# Altium project hd-gs-alt.PrjPcb
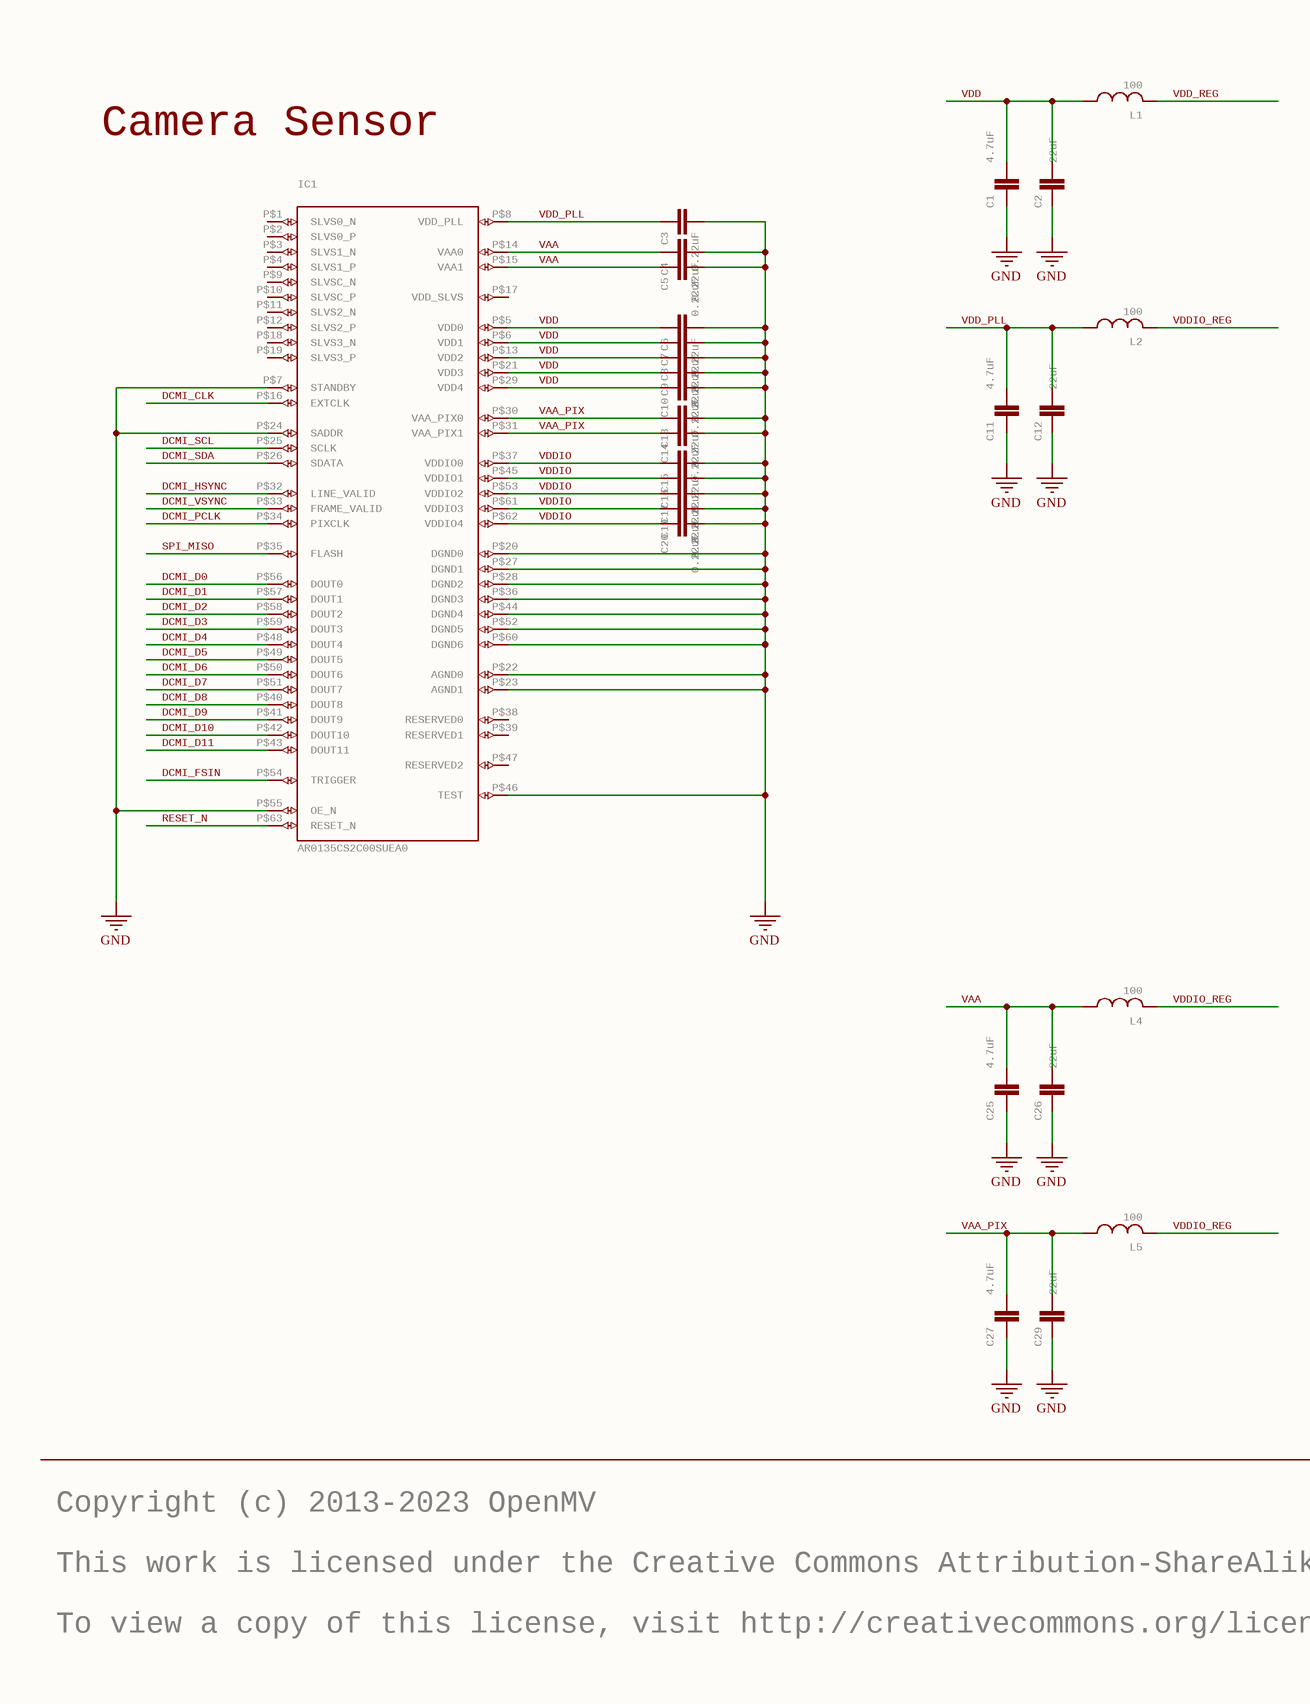
[diagram p0: hd-gs-alt.SchDoc, left]
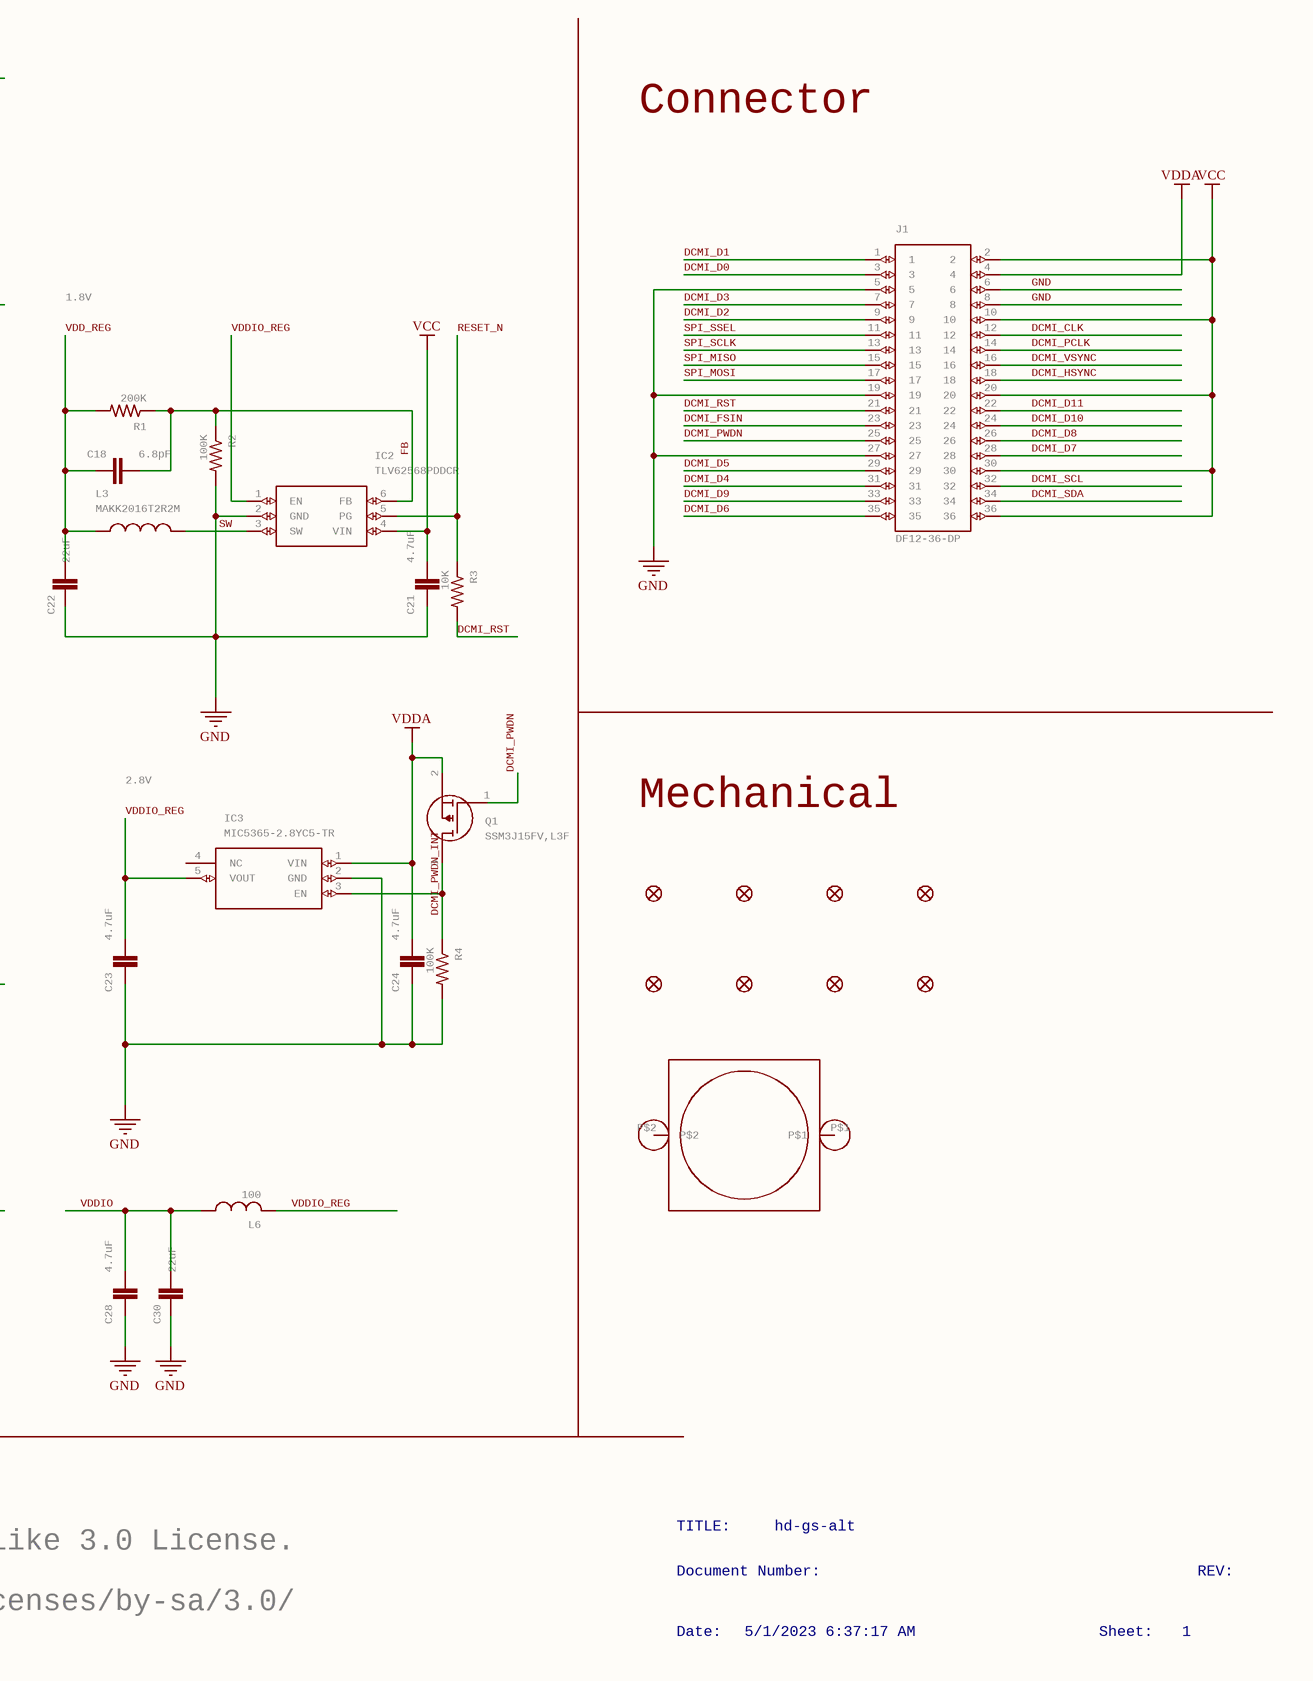
[diagram p1: hd-gs-alt.SchDoc, right]
1 sheet, 54 parts. Net scope: global (net labels, ports and power ports of the same name join across sheets).
Board file: hd-gs-alt.PcbDoc

## Sheet hd-gs-alt.SchDoc: hd-gs-alt
size 453 x 317 mm; Origin: Eagle; Date: 5/1/2023 6:37:17 AM; SheetNumber: 1; GateName_1: G$1; SymbolName_1: FRAME_B_L; LibraryName: frames; DeviceSetName: FRAME_B_L; GateName_2: G$2; SymbolName_2: DOCFIELD; Sheet: Sheet:; REV: REV:

### Parts
C1  4.7uF  [0402]
C2  22uF  [0805]
C3  0.22uF  [C0201]
C4  0.22uF  [C0201]
C5  0.22uF  [C0201]
C6  0.22uF  [C0201]
C7  0.22uF  [C0201]
C8  0.22uF  [C0201]
C9  0.22uF  [C0201]
C10  0.22uF  [C0201]
C11  4.7uF  [0402]
C12  22uF  [0805]
C13  0.22uF  [C0201]
C14  0.22uF  [C0201]
C15  0.22uF  [C0201]
C16  0.22uF  [C0201]
C17  0.22uF  [C0201]
C18  6.8pF  [0402]
C19  0.22uF  [C0201]
C20  0.22uF  [C0201]
C21  4.7uF  [0402]
C22  22uF  [0805]
C23  4.7uF  [0402]
C24  4.7uF  [0402]
C25  4.7uF  [0402]
C26  22uF  [0805]
C27  4.7uF  [0402]
C28  4.7uF  [0402]
C29  22uF  [0805]
C30  22uF  [0805]
FD1  FIDUCIAL1X2  [FIDUCIAL-1X2]  (value not drawn)
FD2  FIDUCIAL1X2  [FIDUCIAL-1X2]  (value not drawn)
FD3  FIDUCIAL1X2  [FIDUCIAL-1X2]  (value not drawn)
FD4  FIDUCIAL1X2  [FIDUCIAL-1X2]  (value not drawn)
FD5  FIDUCIAL1X2  [FIDUCIAL-1X2]  (value not drawn)
FD6  FIDUCIAL1X2  [FIDUCIAL-1X2]  (value not drawn)
FD7  FIDUCIAL1X2  [FIDUCIAL-1X2]  (value not drawn)
FD8  FIDUCIAL1X2  [FIDUCIAL-1X2]  (value not drawn)
H1  LENSMOUNT20MM  [LENSMOUNT-20MM]  (value not drawn)
IC1  AR0135CS2C00SUEA0  [AR0135CS2C00SUEA0]
IC2  TLV62568PDDCR  [SOT95P280X110-6N]
IC3  MIC5365-2.8YC5-TR  [SOT65P210X110-5N]
J1  DF12-36-DP  [DF12-36-DP]
L1  100  [0402]
L2  100  [0402]
L3  MAKK2016T2R2M  [INDC2016X100N]
L4  100  [0402]
L5  100  [0402]
L6  100  [0402]
Q1  SSM3J15FV,L3F  [SSM3J15FV]
R1  200K  [R0402]
R2  100K  [R0402]
R3  10K  [R0402]
R4  100K  [R0402]

### Nets
GND: C1.1 C2.1 C3.2 C4.2 C5.2 C6.2 C7.2 C8.2 C9.2 C10.2 C11.1 C12.1 C13.2 C14.2 C15.2 C16.2 C17.2 C19.2 C20.2 C21.1 C22.1 C23.1 C24.1 C25.1 C26.1 C27.1 C28.1 C29.1 C30.1 IC1.P$7(STANDBY) IC1.P$20(DGND0) IC1.P$22(AGND0) IC1.P$23(AGND1) IC1.P$24(SADDR) IC1.P$27(DGND1) IC1.P$28(DGND2) IC1.P$36(DGND3) IC1.P$44(DGND4) IC1.P$46(TEST) IC1.P$52(DGND5) IC1.P$55(OE_N) IC1.P$60(DGND6) IC2.2(GND) IC3.2(GND) J1.5 J1.6 J1.8 J1.19 J1.27 R2.2 R4.2
VCC: C21.2 IC2.4(VIN) J1.2 J1.10 J1.20 J1.30 J1.36
VDDA: C24.2 IC3.1(VIN) J1.4 Q1.2(S)
DCMI_CLK: IC1.P$16(EXTCLK) J1.12
DCMI_D0: IC1.P$56(DOUT0) J1.3
DCMI_D1: IC1.P$57(DOUT1) J1.1
DCMI_D2: IC1.P$58(DOUT2) J1.9
DCMI_D3: IC1.P$59(DOUT3) J1.7
DCMI_D4: IC1.P$48(DOUT4) J1.31
DCMI_D5: IC1.P$49(DOUT5) J1.29
DCMI_D6: IC1.P$50(DOUT6) J1.35
DCMI_D7: IC1.P$51(DOUT7) J1.28
DCMI_D8: IC1.P$40(DOUT8) J1.26
DCMI_D9: IC1.P$41(DOUT9) J1.33
DCMI_D10: IC1.P$42(DOUT10) J1.24
DCMI_D11: IC1.P$43(DOUT11) J1.22
DCMI_FSIN: IC1.P$54(TRIGGER) J1.23
DCMI_HSYNC: IC1.P$32(LINE_VALID) J1.18
DCMI_PCLK: IC1.P$34(PIXCLK) J1.14
DCMI_PWDN: J1.25 Q1.1(G)
DCMI_PWDN_INT: IC3.3(EN) Q1.3(D) R4.1
DCMI_RST: J1.21 R3.2
DCMI_SCL: IC1.P$25(SCLK) J1.32
DCMI_SDA: IC1.P$26(SDATA) J1.34
DCMI_VSYNC: IC1.P$33(FRAME_VALID) J1.16
FB: C18.2 IC2.6(FB) R1.1 R2.1
RESET_N: IC1.P$63(RESET_N) IC2.5(PG) R3.1
SPI_MISO: IC1.P$35(FLASH) J1.15
SPI_MOSI: J1.17
SPI_SCLK: J1.13
SPI_SSEL: J1.11
SW: IC2.3(SW) L3.2
VAA: C4.1 C5.1 C25.2 C26.2 IC1.P$14(VAA0) IC1.P$15(VAA1) L4.1(P$1)
VAA_PIX: C13.1 C14.1 C27.2 C29.2 IC1.P$30(VAA_PIX0) IC1.P$31(VAA_PIX1) L5.1(P$1)
VDD: C1.2 C2.2 C6.1 C7.1 C8.1 C9.1 C10.1 IC1.P$5(VDD0) IC1.P$6(VDD1) IC1.P$13(VDD2) IC1.P$21(VDD3) IC1.P$29(VDD4) L1.1(P$1)
VDD_PLL: C3.1 C11.2 C12.2 IC1.P$8(VDD_PLL) L2.1(P$1)
VDD_REG: C18.1 C22.2 L1.2(P$2) L3.1 R1.2
VDDIO: C15.1 C16.1 C17.1 C19.1 C20.1 C28.2 C30.2 IC1.P$37(VDDIO0) IC1.P$45(VDDIO1) IC1.P$53(VDDIO2) IC1.P$61(VDDIO3) IC1.P$62(VDDIO4) L6.1(P$1)
VDDIO_REG: C23.2 IC2.1(EN) IC3.5(VOUT) L2.2(P$2) L4.2(P$2) L5.2(P$2) L6.2(P$2)

Not connected (* = marked no-connect by the designer): H1 P$1 P$2; IC1 P$1(SLVS0_N) P$2(SLVS0_P) P$3(SLVS1_N) P$4(SLVS1_P) P$9(SLVSC_N) P$10(SLVSC_P) P$11(SLVS2_N) P$12(SLVS2_P) P$17(VDD_SLVS) P$18(SLVS3_N) P$19(SLVS3_P) P$38(RESERVED0) P$39(RESERVED1) P$47(RESERVED2); IC3 4(NC)

### Notes on the sheet
- Camera Sensor
- Connector
- 1.8V
- 2.8V
- Mechanical
- Copyright (c) 2013-2023 OpenMV
- TITLE:
- hd-gs-alt
- This work is licensed under the Creative Commons Attribution-ShareAlike 3.0 License.
- To view a copy of this license, visit http://creativecommons.org/licenses/by-sa/3.0/
- Document Number:
- REV:
- Date:
- 5/1/2023 6:37:17 AM
- Sheet:
- 1

### Library data of the parts
C1 C11 C21 C23-C25 C27 C28 = CAP_0402: 0402 (1005 Metric) Nick Garner - TeleSense; MPN: JMK105BBJ475MV-F; GateName_1: G$1; SymbolName_1: CAP; LibraryName: 0402; DeviceSetName: CAP_0402
C2 C12 C22 C26 C29 C30 = 22UF-0805-6.3V-20%: 22ÂµF ceramic capacitors    A capacitor is a passive two-terminal electrical component used to store electrical energy temporarily in an electric field.; MPN: CL21A226MQQNNNE; GateName_1: G$1; SymbolName_1: CAP; PROD_ID: CAP-08402; DeviceName: -0805-6.3V-20%; LibraryName: SparkFun-Capacitors; DeviceSetName: 22UF
C3-C10 C13-C17 C19 C20 = C-EUC0201: CAPACITOR, European symbol; MPN: GRM033R60J224ME15D; GateName_1: G$1; SymbolName_1: C-EU; POPULARITY: 0; DeviceName: C0201; LibraryName: rcl; DeviceSetName: C-EU; SPICEPREFIX: C
C18 = CAP_0402: 0402 (1005 Metric) Nick Garner - TeleSense; MPN: GRM1555C1H6R8DA01D; GateName_1: G$1; SymbolName_1: CAP; LibraryName: 0402; DeviceSetName: CAP_0402
FD1-FD8 = FIDUCIAL1X2: Fiducial Alignment Points    Point-of-reference for pick-and-place machines and other optical instruments.; GateName_1: G$1; DeviceName: 1X2; SymbolName_1: FIDUCIAL; LibraryName: SparkFun-Aesthetics; DeviceSetName: FIDUCIAL
H1 = LENSMOUNT20MM: GateName_1: G$1; SymbolName_1: LENS; DeviceName: 20MM; LibraryName: lensmount; DeviceSetName: LENSMOUNT
IC1 = AR0135CS2C00SUEA0: MPN: AR0135CS2C00SUEA0-DRBR; GateName_1: G$1; SymbolName_1: AR0135CS2C00SUEA0; LibraryName: AR0135CS2C00SUEA0; DeviceSetName: AR0135CS2C00SUEA0
IC2 = TLV62568PDDCR: 2.5V-5.5V input, 1A high efficiency step-down buck converter in SOT23 and SOT563 package   Source:  Datasheet; MANUFACTURER_NAME: Texas Instruments; GateName_1: G$1; SymbolName_1: TLV62568PDDCR; LibraryName: TLV62568PDDCR; DeviceSetName: TLV62568PDDCR; HEIGHT: 1.1mm; MANUFACTURER_PART_NUMBER: TLV62568PDDCR; MOUSER_PART_NUMBER: 595-TLV62568PDDCR; MOUSER_PRICE-STOCK: https://www.mouser.co.uk/ProductDetail/Texas-Instruments/TLV62568PDDCR?qs=1mbolxNpo8f1FPchIXcxyQ%3D%3D; MPN: TLV62568PDDCR
IC3 = MIC5365-2.8YC5-TR: IC REG LINEAR 2.8V 150MA SC70-5   Source:  Datasheet; MANUFACTURER_NAME: Microchip; GateName_1: G$1; SymbolName_1: MIC5365-2.8YC5-TR; LibraryName: MIC5365-2.8YC5-TR; DeviceSetName: MIC5365-2.8YC5-TR; HEIGHT: 1.1mm; MANUFACTURER_PART_NUMBER: MIC5365-2.8YC5-TR; MOUSER_PART_NUMBER: 998-MIC5365-2.8YC5TR; MOUSER_PRICE-STOCK: https://www.mouser.co.uk/ProductDetail/Microchip-Technology-Atmel/MIC5365-2.8YC5-TR?qs=U6T8BxXiZAX3mJDSWJyjVA%3D%3D; MPN: MIC5365-2.8YC5-TR
J1 = DF12-36-DP: MPN: DF12NB(3.0)-36DP-0.5V(51); GateName_1: G$1; SymbolName_1: DF12-36; LibraryName: DF12NB(3.0)-36DP-0.5V(51); DeviceSetName: DF12-36-DP
L1 L2 L4-L6 = INDUCTOR_0402: MPN: MFBM1V1005-101-R; GateName_1: G$1; SymbolName_1: INDUCTOR; LibraryName: 0402; DeviceSetName: INDUCTOR_0402
L3 = MAKK2016T2R2M: INDUCTOR, METAL CORE Check availability; GateName_1: G$1; MF: Taiyo Yuden; SymbolName_1: MAKK2016T2R2M; LibraryName: MAKK2016T2R2M; DeviceSetName: MAKK2016T2R2M; AVAILABILITY: In Stock; MP: MAKK2016T2R2M; MPN: MAKK2016T2R2M; PACKAGE: 2016 Taiyo Yuden; PRICE: None; PURCHASE-URL: https://pricing.snapeda.com/search/part/MAKK2016T2R2M/?ref=eda
Q1 = PMXB120EPEZ: MOSFET 30 V, P-channel Trench MOSFET   Source:  Datasheet; GateName_1: G$1; SymbolName_1: SSM3J15FV,L3F; LibraryName: SSM3J15FV,L3F; DeviceSetName: SSM3J15FV,L3F; HEIGHT: 0.4mm; MANUFACTURER_PART_NUMBER: SSM3J15FV,L3F; MPN: SSM3J15FV,L3F
R1 = R-US_R0402: RESISTOR, American symbol; MPN: CRCW0402200KFKEDC; GateName_1: G$1; SymbolName_1: R-US; DeviceSetName: R-US_; POPULARITY: 34; DeviceName: R0402; LibraryName: rcl; SPICEPREFIX: R
R2 R4 = R-US_R0402: RESISTOR, American symbol; MPN: AC0402FR-07100KL; GateName_1: G$1; SymbolName_1: R-US; DeviceSetName: R-US_; POPULARITY: 34; DeviceName: R0402; LibraryName: rcl; SPICEPREFIX: R
R3 = R-US_R0402: RESISTOR, American symbol; MPN: AC0402FR-1310KL; GateName_1: G$1; SymbolName_1: R-US; DeviceSetName: R-US_; POPULARITY: 34; DeviceName: R0402; LibraryName: rcl; SPICEPREFIX: R